# EAGLE board p0x2 (EAGLE 4.11)
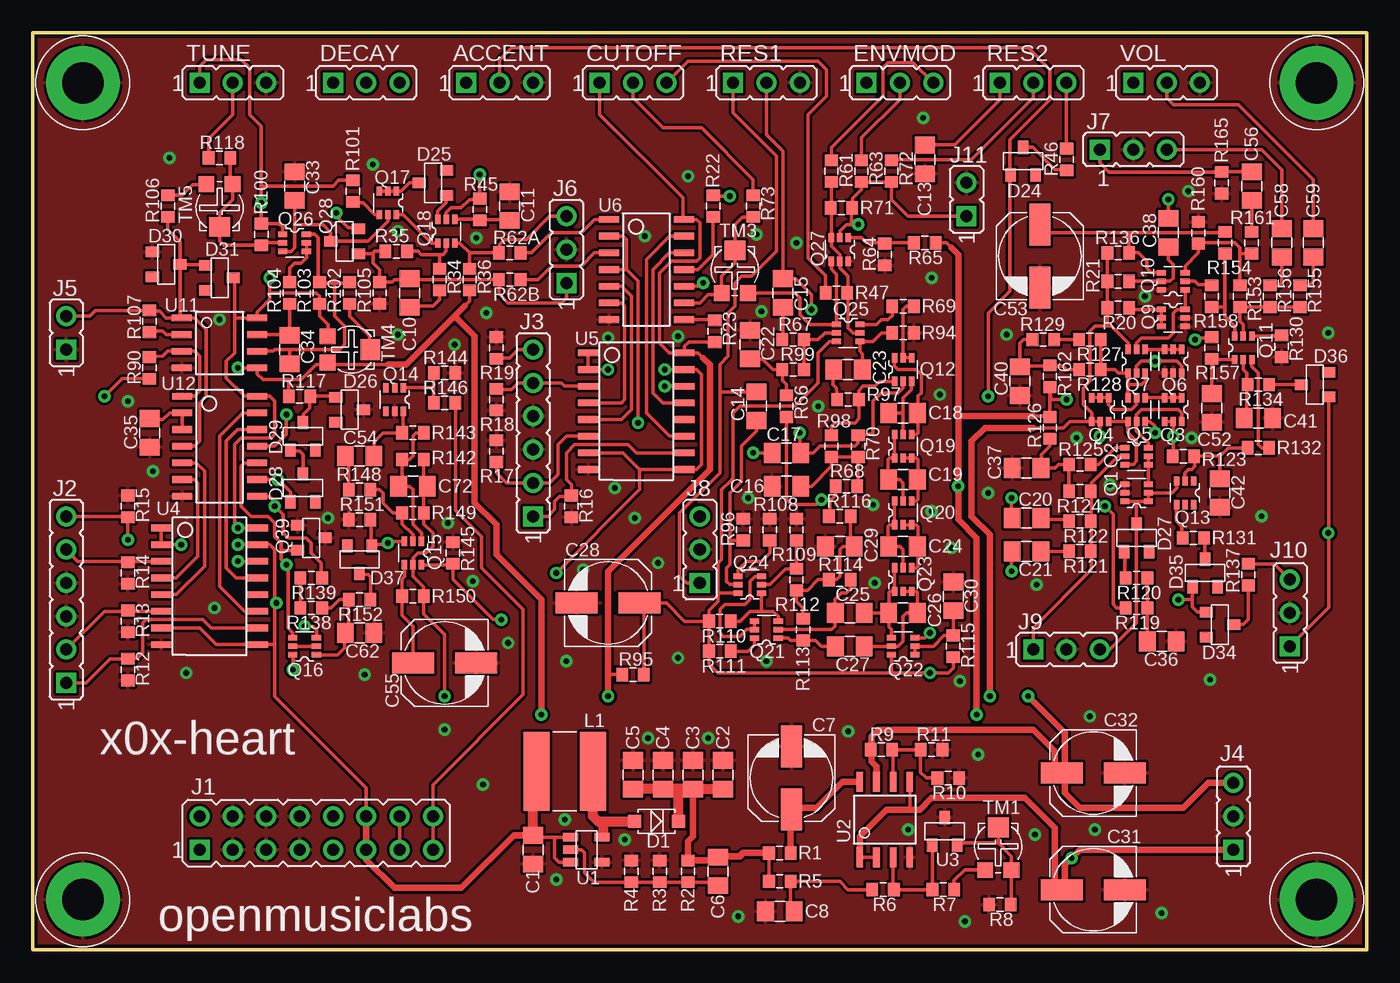
[diagram p1: board, top side]
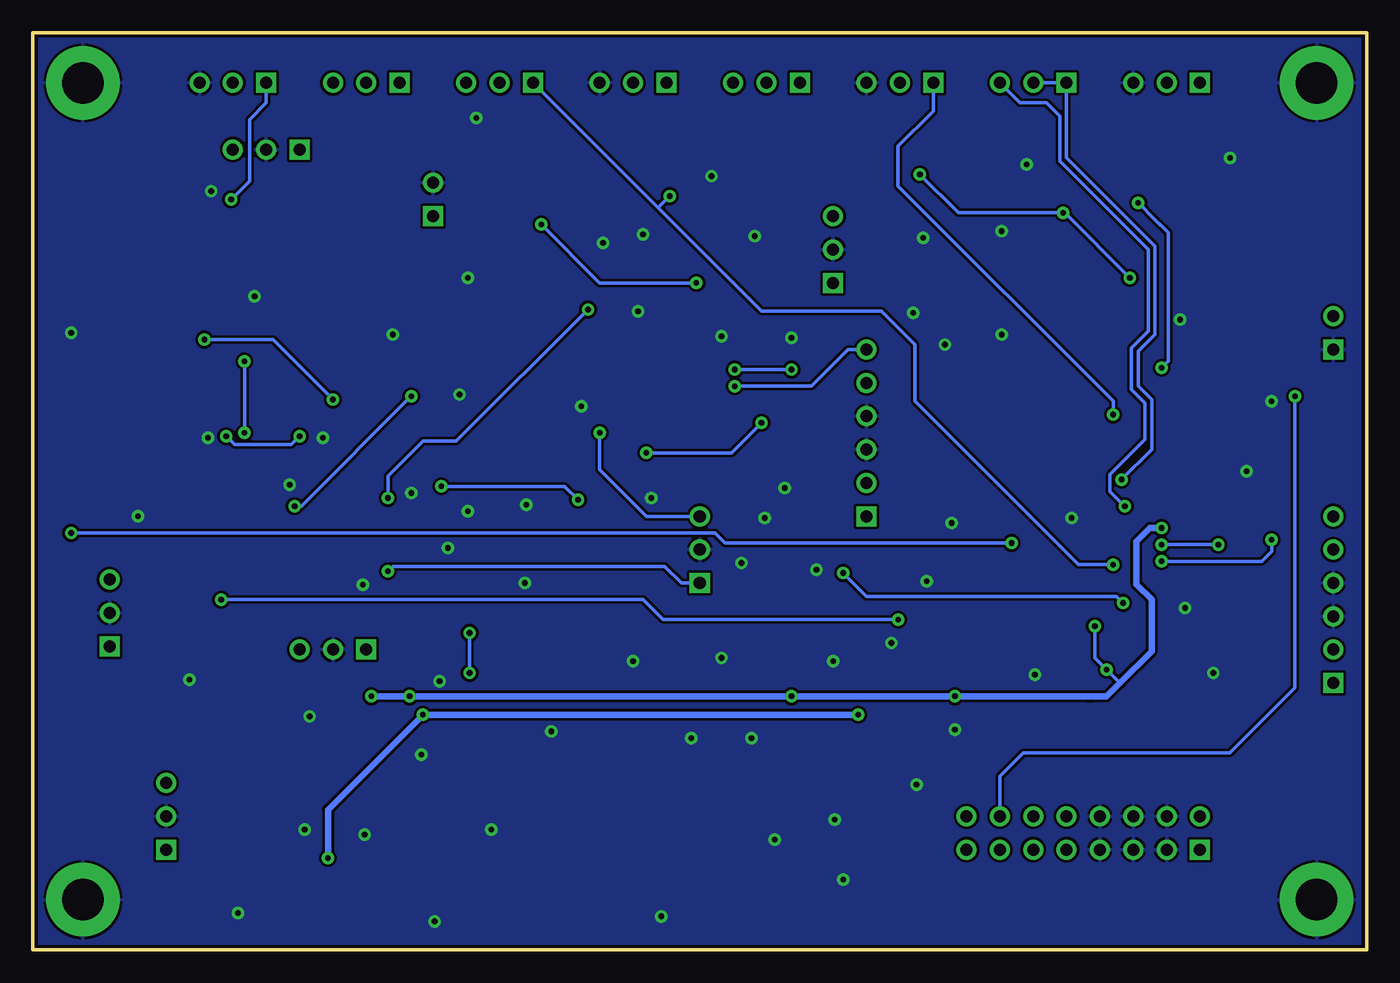
[diagram p2: board, bottom side, seen from below]

Size 101.6 x 69.85 mm. Coordinates in mm from the lower left corner, seen from the top.
Outline: 0,0 0,69.85 101.6,69.85 101.6,0 0,0
Copper layers (1*16): Top 0.035mm / dielectric 1.5mm / Bottom 0.035mm
Design rules "default": minimum track width 8mil, minimum drill 16mil, track to track 8mil, track to pad 8mil, pad to pad 8mil, via to via 8mil, smd to smd 8mil, copper to edge 10mil, drill to drill 8mil, minimum pad ring 10mil, minimum via ring 8mil, stop-mask expansion 4mil, vias tented up to drill 20mil, thermal gap 8mil

## Footprints (pad centres in the part's own frame; a part is rotated, then mirrored left to right if it is on the bottom)
JMP/3P/SIP = drill 0.914 pad 1.524 square: 1 -2.54,0 | drill 0.914 pad 1.524 round: 2 0,0; 3 2.54,0
0805/SMALL = smd 1.27 x 1.524: 1 -1.091,0; 2 1.091,0
CAP/6.3X5.3/SMD = smd 1.6 x 3.2: P$1 0,2.4; P$2 0,-2.4
SOD-123 = smd 1 x 1: P$1 -1.678,0; P$2 1.678,0
SOT-23-3 = smd 0.8 x 1: P$1 0,1.05; P$2 0.95,-1.05; P$3 -0.95,-1.05
JMP/16P/DIP = drill 0.914 pad 1.524 square: 1 -1.27,8.89 | drill 0.914 pad 1.524 round: 2 1.27,8.89; 3 -1.27,6.35; 4 1.27,6.35; 5 -1.27,3.81; 6 1.27,3.81; 7 -1.27,1.27; 8 1.27,1.27; 9 -1.27,-1.27; 10 1.27,-1.27; 11 -1.27,-3.81; 12 1.27,-3.81; 13 -1.27,-6.35; 14 1.27,-6.35; 15 -1.27,-8.89; 16 1.27,-8.89
JMP/6P/SIP = drill 0.914 pad 1.524 square: 1 -6.35,0 | drill 0.914 pad 1.524 round: 2 -3.81,0; 3 -1.27,0; 4 1.27,0; 5 3.81,0; 6 6.35,0
JMP/2P/SIP = drill 0.914 pad 1.524 square: 1 -1.27,0 | drill 0.914 pad 1.524 round: 2 1.27,0
H0LE/PAD/4-40 = drill 3.175 pad 5.588 round: P$1 0,0
SRN6045 = smd 6 x 2: P$1 0,-2.15; P$2 0,2.15
SOT363 = smd 0.42 x 0.7: P$1 -0.65,-0.9; P$2 0,-0.9; P$3 0.65,-0.9; P$4 0.65,0.9; P$5 0,0.9; P$6 -0.65,0.9
0603-SM = smd 0.889 x 1.016: P$1 -0.826,0; P$2 0.826,0
TC33X = smd 1.2 x 1.2: P$1 -1,-1.8; P$3 1,-1.8 | smd 1.6 x 1.5: P$2 0,1.45
SOT23-5 = smd 0.635 x 1.143: P$1 -0.95,-1.2; P$2 0,-1.2; P$3 0.95,-1.2; P$4 0.95,1.2; P$5 -0.95,1.2
8-SOIC = smd 1.524 x 0.508: 1 -2.87,1.905; 2 -2.87,0.635; 3 -2.87,-0.635; 4 -2.87,-1.905; 5 2.87,-1.905; 6 2.87,-0.635; 7 2.87,0.635; 8 2.87,1.905
16-SOIC/WIDE = smd 1.524 x 0.508: 1 -3.683,4.445; 2 -3.683,3.175; 3 -3.683,1.905; 4 -3.683,0.635; 5 -3.683,-0.635; 6 -3.683,-1.905; 7 -3.683,-3.175; 8 -3.683,-4.445; 9 3.683,-4.445; 10 3.683,-3.175; 11 3.683,-1.905; 12 3.683,-0.635; 13 3.683,0.635; 14 3.683,1.905; 15 3.683,3.175; 16 3.683,4.445
14-SOIC = smd 1.524 x 0.508: 1 -2.857,3.81; 2 -2.857,2.54; 3 -2.857,1.27; 4 -2.857,0; 5 -2.857,-1.27; 6 -2.857,-2.54; 7 -2.857,-3.81; 8 2.857,-3.81; 9 2.857,-2.54; 10 2.857,-1.27; 11 2.857,0; 12 2.857,1.27; 13 2.857,2.54; 14 2.857,3.81

## Placement (x,y rotation side)
ACCENT  50kB  [JMP/3P/SIP]  35.56,66.04 0 top
C1  10uF  [0805/SMALL]  38.1,7.62 270 top
C2  1uF  [0805/SMALL]  52.58,13.34 90 top
C3  1uF  [0805/SMALL]  50.29,13.34 90 top
C4  1uF  [0805/SMALL]  48.01,13.34 90 top
C5  1uF  [0805/SMALL]  45.72,13.34 90 top
C6  1nF  [0805/SMALL]  52.2,5.97 270 top
C7  47uF  [CAP/6.3X5.3/SMD]  57.78,13.08 180 top
C8  10uF  [0805/SMALL]  56.9,2.92 180 top
C10  10nF  [0805/SMALL]  28.7,50.04 90 top
C11  1uF  [0805/SMALL]  36.32,56.64 270 top
C13  1uF  [0805/SMALL]  67.94,60.2 270 top
C14  1uF  [0805/SMALL]  55.12,41.4 90 top
C15  1uF  [0805/SMALL]  57.15,50.04 90 top
C16  10uF  [0805/SMALL]  57.4,35.31 0 top
C17  1uF  [0805/SMALL]  57.4,37.85 180 top
C18  18nF  [0805/SMALL]  66.29,40.89 180 top
C19  33nF  [0805/SMALL]  66.29,35.81 180 top
C20  10nF  [0805/SMALL]  75.69,32.89 180 top
C21  10nF  [0805/SMALL]  75.69,30.35 180 top
C22  1uF  [0805/SMALL]  54.61,46.1 90 top
C23  1uF  [0805/SMALL]  62.1,44.2 180 top
C24  33nF  [0805/SMALL]  66.29,30.73 180 top
C25  100nF  [0805/SMALL]  62.23,25.65 180 top
C26  33nF  [0805/SMALL]  66.29,25.65 180 top
C27  100nF  [0805/SMALL]  62.23,23.11 0 top
C28  47uF  [CAP/6.3X5.3/SMD]  43.81,26.42 270 top
C29  1uF  [0805/SMALL]  61.47,30.73 180 top
C30  10uF  [0805/SMALL]  70.1,26.92 90 top
C31  47uF  [CAP/6.3X5.3/SMD]  80.77,4.57 90 top
C32  47uF  [CAP/6.3X5.3/SMD]  80.77,13.46 90 top
C33  10nF  [0805/SMALL]  19.94,58.17 90 top
C34  1nF  [0805/SMALL]  19.56,45.72 270 top
C35  100nF  [0805/SMALL]  8.89,39.37 270 top
C36  33nF  [0805/SMALL]  85.98,23.5 0 top
C37  10uF  [0805/SMALL]  75.69,36.7 180 top
C38  1uF  [0805/SMALL]  86.49,54.61 270 top
C40  10uF  [0805/SMALL]  75.18,43.31 270 top
C41  100nF  [0805/SMALL]  93.34,40.51 0 top
C42  1uF  [0805/SMALL]  90.42,34.8 270 top
C52  10uF  [0805/SMALL]  89.79,41.27 90 top
C53  47uF  [CAP/6.3X5.3/SMD]  76.71,52.83 0 top
C54  47nF  [0805/SMALL]  24.89,37.59 0 top
C55  47uF  [CAP/6.3X5.3/SMD]  31.37,21.84 90 top
C56  1uF  [0805/SMALL]  92.84,58.17 270 top
C58  1uF  [0805/SMALL]  95.12,53.85 90 top
C59  1uF  [0805/SMALL]  97.54,53.85 90 top
C62  1uF  [0805/SMALL]  24.89,24.13 180 top
C72  10uF  [0805/SMALL]  28.96,35.31 0 top
CUTOFF  50kA  [JMP/3P/SIP]  45.72,66.04 0 top
D1  MBR0530  [SOD-123]  47.5,9.78 180 top
D24  [SOT-23-3]  75.44,60.07 0 top
D25  [SOT-23-3]  30.48,58.42 90 top
D26  [SOT-23-3]  24.13,41.15 270 top
D27  [SOT-23-3]  84.07,31.37 0 top
D28  [SOT-23-3]  20.57,35.18 0 top
D29  [SOT-23-3]  20.57,39.12 0 top
D30  [SOT-23-3]  10.16,52.2 270 top
D31  [SOT-23-3]  14.22,51.18 270 top
D34  [SOT-23-3]  90.42,24.77 270 top
D35  [SOT-23-3]  89.28,28.7 0 top
D36  [SOT-23-3]  97.66,43.05 90 top
D37  [SOT-23-3]  24.89,29.72 180 top
DECAY  1MA  [JMP/3P/SIP]  25.4,66.04 0 top
ENVMOD  50kA  [JMP/3P/SIP]  66.04,66.04 0 top
J1  [JMP/16P/DIP]  21.59,8.89 90 top
J2  [JMP/6P/SIP]  2.54,26.67 90 top
J3  [JMP/6P/SIP]  38.1,39.37 90 top
J4  [JMP/3P/SIP]  91.44,10.16 90 top
J5  [JMP/2P/SIP]  2.54,46.99 90 top
J6  [JMP/3P/SIP]  40.64,53.34 90 top
J7  [JMP/3P/SIP]  83.82,60.96 0 top
J8  [JMP/3P/SIP]  50.8,30.48 90 top
J9  [JMP/3P/SIP]  78.74,22.86 0 top
J10  [JMP/3P/SIP]  95.76,25.65 90 top
J11  [JMP/2P/SIP]  71.12,57.15 90 top
J12  [H0LE/PAD/4-40]  3.81,66.04 0 top
J13  [H0LE/PAD/4-40]  3.81,3.81 0 top
J14  [H0LE/PAD/4-40]  97.79,66.04 0 top
J15  [H0LE/PAD/4-40]  97.79,3.81 0 top
L1  SRN6045-8R2M  [SRN6045]  40.51,13.59 270 top
Q1  [SOT363]  84.07,34.8 90 top
Q2  [SOT363]  84.07,37.59 270 top
Q3  [SOT363]  86.87,41.15 180 top
Q4  [SOT363]  81.28,41.15 180 top
Q5  [SOT363]  84.07,41.15 0 top
Q6  [SOT363]  86.87,44.83 180 top
Q7  [SOT363]  84.07,44.83 0 top
Q9  [SOT363]  86.87,48.13 270 top
Q10  [SOT363]  86.87,50.93 90 top
Q11  [SOT363]  92.2,45.85 0 top
Q12  [SOT363]  66.29,44.2 0 top
Q13  [SOT363]  87.76,34.8 180 top
Q14  [SOT363]  27.56,41.91 180 top
Q15  [SOT363]  28.96,30.23 180 top
Q16  [SOT363]  20.7,23.11 90 top
Q17  [SOT363]  27.05,56.9 180 top
Q18  [SOT363]  31.5,54.74 0 top
Q19  [SOT363]  66.29,38.35 0 top
Q20  [SOT363]  66.29,33.27 0 top
Q21  [SOT363]  55.88,24.38 90 top
Q22  [SOT363]  66.29,23.11 90 top
Q23  [SOT363]  66.29,28.19 0 top
Q24  [SOT363]  54.61,27.81 90 top
Q25  [SOT363]  62.1,46.99 270 top
Q26  [SOT363]  19.94,53.85 270 top
Q27  [SOT363]  61.47,53.34 180 top
Q28  2SK3666-2  [SOT-23-3]  23.75,53.98 90 top
Q39  2SK3666-3  [SOT-23-3]  21.21,31.37 270 top
R1  100  [0603-SM]  56.9,7.37 0 top
R2  100k  [0603-SM]  49.91,5.97 90 top
R3  47k  [0603-SM]  47.75,5.97 270 top
R4  10k  [0603-SM]  45.59,5.97 270 top
R5  1k  [0603-SM]  56.9,5.21 0 top
R6  10k  [0603-SM]  64.77,4.57 180 top
R7  10k  [0603-SM]  69.34,4.57 180 top
R8  10k  [0603-SM]  73.66,3.43 0 top
R9  2.2k  [0603-SM]  64.64,15.24 180 top
R10  10k  [0603-SM]  69.72,13.08 180 top
R11  2.2k  [0603-SM]  68.45,15.24 180 top
R12  100k  [0603-SM]  7.24,21.34 90 top
R13  100k  [0603-SM]  7.24,25.02 90 top
R14  100k  [0603-SM]  7.24,28.7 90 top
R15  100k  [0603-SM]  7.24,33.78 270 top
R16  100k  [0603-SM]  41.02,33.78 90 top
R17  100k  [0603-SM]  35.31,37.97 270 top
R18  100k  [0603-SM]  35.31,41.91 90 top
R19  100k  [0603-SM]  35.31,45.85 270 top
R20  47k  [0603-SM]  82.68,48.9 0 top
R21  10k  [0603-SM]  82.68,50.93 0 top
R22  220k  [0603-SM]  51.82,56.64 90 top
R23  47k  [0603-SM]  51.94,47.12 270 top
R34  10k  [0603-SM]  30.99,51.05 90 top
R35  100k  [0603-SM]  27.69,53.21 0 top
R36  10k  [0603-SM]  33.27,51.05 90 top
R45  22k  [0603-SM]  34.04,56.39 270 top
R46  47k  [0603-SM]  78.74,60.2 90 top
R47  10k  [0603-SM]  61.21,50.04 0 top
R61  10k  [0603-SM]  60.83,59.31 90 top
R62A  220k  [0603-SM]  36.32,53.09 180 top
R62B  220k  [0603-SM]  36.32,51.05 180 top
R63  220k  [0603-SM]  63.12,59.31 90 top
R64  10k  [0603-SM]  64.9,52.96 90 top
R65  10k  [0603-SM]  67.94,53.85 0 top
R66  100k  [0603-SM]  57.4,41.4 90 top
R67  2.2k  [0603-SM]  57.91,46.48 0 top
R68  2.2k  [0603-SM]  61.98,35.31 180 top
R69  2.2k  [0603-SM]  66.29,49.02 0 top
R70  2.2k  [0603-SM]  62.87,38.35 90 top
R71  2.2k  [0603-SM]  61.59,56.52 0 top
R72  100k  [0603-SM]  65.41,59.31 90 top
R73  100k  [0603-SM]  54.86,56.64 90 top
R90  220k  [0603-SM]  8.89,44.32 90 top
R94  10k  [0603-SM]  66.29,46.99 180 top
R95  100  [0603-SM]  45.72,20.95 180 top
R96  10k  [0603-SM]  54.1,32 90 top
R97  10k  [0603-SM]  62.1,41.91 180 top
R98  2.2k  [0603-SM]  60.83,38.35 90 top
R99  100k  [0603-SM]  57.91,44.2 180 top
R100  560  [0603-SM]  17.4,54.48 270 top
R101  10k  [0603-SM]  24.38,57.78 270 top
R102  100k  [0603-SM]  24.13,50.04 270 top
R103  220k  [0603-SM]  21.84,50.04 270 top
R104  2.2k  [0603-SM]  19.56,50.04 90 top
R105  10k  [0603-SM]  26.42,50.04 90 top
R106  27k  [0603-SM]  10.29,56.64 90 top
R107  220k  [0603-SM]  8.89,47.88 90 top
R108  2.2k  [0603-SM]  56.13,32 90 top
R109  10k  [0603-SM]  58.17,32 90 top
R110  22k  [0603-SM]  52.32,25.02 0 top
R111  22k  [0603-SM]  52.32,22.73 0 top
R112  10k  [0603-SM]  58.17,28.19 90 top
R113  100k  [0603-SM]  58.67,24.38 90 top
R114  100k  [0603-SM]  61.47,28.19 180 top
R115  10k  [0603-SM]  70.1,23.11 90 top
R116  10k  [0603-SM]  61.47,33.02 0 top
R117  22k  [0603-SM]  20.32,42.16 0 top
R118  100k  [0603-SM]  14.22,60.33 180 top
R119  47k  [0603-SM]  84.07,26.04 0 top
R120  22k  [0603-SM]  84.07,28.32 180 top
R121  220k  [0603-SM]  79.76,30.35 180 top
R122  100k  [0603-SM]  79.76,32.64 180 top
R123  1.5M  [0603-SM]  87.63,37.59 0 top
R124  2.2k  [0603-SM]  79.76,34.92 0 top
R125  2.2k  [0603-SM]  79.76,36.96 0 top
R126  2.2k  [0603-SM]  77.47,39.75 270 top
R127  47k  [0603-SM]  80.52,46.48 180 top
R128  220k  [0603-SM]  80.52,44.2 180 top
R129  22k  [0603-SM]  76.96,46.48 180 top
R130  100  [0603-SM]  95.12,45.97 90 top
R131  220k  [0603-SM]  88.39,31.37 180 top
R132  100  [0603-SM]  93.34,38.23 0 top
R134  22k  [0603-SM]  93.34,43.05 0 top
R136  100  [0603-SM]  82.68,53.09 0 top
R137  1k  [0603-SM]  92.58,28.57 270 top
R138  47k  [0603-SM]  21.21,26.04 0 top
R139  22k  [0603-SM]  21.21,28.32 180 top
R142  10k  [0603-SM]  28.96,37.34 0 top
R143  10k  [0603-SM]  28.96,39.37 0 top
R144  10k  [0603-SM]  31.37,43.94 0 top
R145  10k  [0603-SM]  32,30.23 270 top
R146  22k  [0603-SM]  31.37,41.66 180 top
R148  10k  [0603-SM]  24.89,35.05 0 top
R149  10k  [0603-SM]  28.96,33.27 0 top
R150  22  [0603-SM]  28.96,26.92 0 top
R151  22k  [0603-SM]  24.89,32.77 0 top
R152  100  [0603-SM]  24.89,26.67 0 top
R153  100k  [0603-SM]  91.95,49.78 90 top
R154  100k  [0603-SM]  90.81,53.85 90 top
R155  47k  [0603-SM]  96.52,49.78 270 top
R156  100k  [0603-SM]  94.23,49.78 270 top
R157  10k  [0603-SM]  89.79,45.85 270 top
R158  10k  [0603-SM]  89.79,49.78 90 top
R160  10k  [0603-SM]  88.77,54.61 270 top
R161  1k  [0603-SM]  92.84,53.85 270 top
R162  2.2k  [0603-SM]  77.47,43.69 90 top
R165  100k  [0603-SM]  90.55,58.42 270 top
RES1  50kB  [JMP/3P/SIP]  55.88,66.04 0 top
RES2  50kB  [JMP/3P/SIP]  76.2,66.04 0 top
TM1  5k  [TC33X]  73.53,7.87 0 top
TM3  500k  [TC33X]  53.47,51.82 0 top
TM4  50k  [TC33X]  24.26,45.72 270 top
TM5  5k  [TC33X]  14.22,56.52 180 top
TUNE  50kB  [JMP/3P/SIP]  15.24,66.04 0 top
U1  NCP1406  [SOT23-5]  42.16,7.62 270 top
U2  LM358  [8-SOIC]  64.9,9.91 90 top
U3  TLV431  [SOT-23-3]  69.47,9.02 0 top
U4  CD40109  [16-SOIC/WIDE]  13.46,27.69 0 top
U5  CD40109  [16-SOIC/WIDE]  45.97,41.02 0 top
U6  CD4066  [14-SOIC]  46.74,51.82 0 top
U11  LM358  [8-SOIC]  14.22,46.23 0 top
U12  CD4066  [14-SOIC]  14.22,38.35 0 top
VOL  50kA  [JMP/3P/SIP]  86.36,66.04 0 top

## Tracks (layer width: path | path; a pad name or v marks a point on that pad's centre or on a via)
+5V  (via drill 0.43 pad 0.94)
  Top 0.254: 19.04,54.99 Q26.P$1 | 19.04,54.99 19.04,55 | v15.62,44.32 U11.5 17.09,43.87 17.53,43.43 19.43,43.43 | 69.98,53.47 69.6,53.85 R65.P$2 | U2.2 64.26,6.99 64.21,7.04 U2.1 | 66.8,12.83 U2.5 66.8,10.67 66.8,10.54 | R101.P$1 23.3,58.61 22.86,58.17 17.4,58.17 | 19.04,54.99 19.05,54.99 18.73,55.31 R100.P$1 v17.4,56.9 17.4,58.17 | 17.4,58.17 17.4,62.74 16.51,63.63 16.51,67.18 15.88,67.82 13.21,67.82 12.7,67.31 TUNE.1 | 19.43,43.43 19.56,43.43 19.49,43.37 R117.P$1 | 19.43,43.43 20.45,43.43 21.59,44.58 22.23,44.58 | TM4.P$3 22.35,44.62 22.35,44.58 22.23,44.58 | 27.05,44.58 22.23,44.58 | 33.27,50.29 33.27,50.42 | 33.27,50.29 R36.P$1 | 32.89,49.02 33.27,49.4 33.27,50.29 | v78.74,41.91 77.53,41.91 R162.P$1 77.47,40.77 77.34,40.64 | R157.P$1 89.79,46.61 88.65,46.61 v88.52,46.48 | R116.P$1 60.71,33.02 60.71,33.91 | 60.71,33.91 60.71,34.04 | R126.P$1 77.41,40.64 77.34,40.64 | 76.2,40.64 77.34,40.64 | 60.71,34.29 v60.07,34.29 59.69,33.91 57.78,33.91 57.4,34.29 R66.P$1 | 60.71,34.29 60.71,33.91 | 60.71,34.29 60.83,34.29 61.15,34.61 R68.P$2
  Top 0.508: 62.99,6.99 U2.1 62.99,8.64 65.02,10.67 66.8,10.67 67.56,10.67 68.45,11.56 75.56,11.56 77.85,9.27 77.85,4.7 77.98,4.57 C31.P$1 78.61,4.81 78.61,6.48 v79.12,6.99 79.76,7.62 J4.1 | v38.73,17.91 38.73,26.67 35.31,30.1 35.31,32.38 33.66,34.04 33.66,46.74 32.13,48.26 | 27.05,44.58 28.45,44.58 32.13,48.26 | 32.13,48.26 32.89,49.02 | v71.88,17.91 71.88,31.37 70.48,32.77 v70.48,35.31 70.48,41.15 | 70.48,41.15 70.48,52.96 69.98,53.47 | 76.2,40.64 70.48,40.64 70.48,41.15
  Bottom 0.254: 15.62,44.2 v15.62,44.32 15.11,44.83 15.11,54.61 16.13,55.63 | 16.13,55.63 v17.4,56.9 | 16.13,55.63 15.62,55.12 | v78.74,41.91 83.31,46.48 v88.52,46.48 | v70.48,35.31 61.09,35.31 v60.07,34.29
  Bottom 0.508: v79.12,6.99 79.12,10.67 v71.88,17.91 v38.73,17.91
+12V  (via drill 0.43 pad 0.94)
  Top 0.254: 39.75,8.57 38.1,8.57 C1.1 | 39.75,8.57 U1.P$1 | U1.P$3 40.07,6.67 39.75,6.99 39.75,8.57 | J1.12 25.4,12.32 18.41,19.3 18.41,23.24 | v15.62,30.86 U4.15 18.03,30.86 18.41,30.48 18.41,26.42 | U4.2 v11.3,30.86 U4.2 | U4.7 12.7,24.51 13.97,23.24 U4.9 18.41,23.24 | 18.41,23.24 18.41,26.42 | 43.81,37.85 U5.7 44.96,37.85 46.23,36.58 | v48.13,44.2 U5.15 50.55,44.2 50.93,43.81 50.93,36.96 50.55,36.58 U5.9 46.23,36.58 | v43.81,44.2 U5.2 U5.1 | v39.88,28.7 46.23,35.05 46.23,36.58 | U4.2 U4.1 | 18.41,26.42 v18.54,26.42
  Top 0.508: J1.12 J1.11 25.4,6.86 27.56,4.7 32.64,4.7 36.65,8.71 C1.1
  Top 0.762: L1.P$1 38.48,13.59 38.1,13.21 C1.1
  Bottom 0.254: v15.62,30.86 v11.3,30.86 | v48.13,44.2 v43.81,44.2 | v39.88,28.7 38.1,26.92 19.05,26.92 v18.54,26.42
ENVMOD  (via drill 0.43 pad 0.94)
  Top 0.254: Q16.P$4 19.8,24.14 19.43,24.51 19.43,29.21 v19.3,29.34 18.92,29.72 18.92,30.48 | 17.14,37.08 U12.10 16.13,37.08 15.88,36.83 15.88,33.78 16.64,33.02 17.91,33.02 18.41,32.51 18.41,31.5 18.92,30.99 18.92,30.48 | Q39.P$2 18.98,30.42 18.92,30.48 | R22.P$2 51.82,57.4 v53.09,57.4
  Bottom 0.254: v19.3,29.34 21.97,29.34 34.42,41.78 34.42,46.1 36.96,48.64 46.1,48.64 53.98,56.52 | 53.98,56.52 ENVMOD.1 | 53.98,56.52 v53.09,57.4
N$1
  Top 0.254: R137.P$1 94.55,29.4 J10.3
N$2
  Top 0.254: R139.P$2 R138.P$1 20.45,26.29
N$3
  Top 0.254: U6.11 50.67,51.82 51.82,52.96 R22.P$1
N$4
  Top 0.254: R90.P$2 9.91,45.21 10.29,45.59 U11.3 12.32,45.59 12.7,45.21 12.7,42.55 12.32,42.16 U12.1 11.3,42.16
N$5
  Top 0.254: 11.3,38.35 U12.4 12.32,38.35 12.7,38.73 12.7,41.66 13.21,42.16 13.21,47.24 12.32,48.13 U11.1 11.3,48.13 | 11.3,48.13 10.16,48.13 9.65,48.64 8.76,48.64 8.83,48.7 R107.P$2 4.76,48.7 4.32,48.26 J5.2 | D31.P$3 13.21,52.16 13.21,52.2 D30.P$1 | D30.P$1 11.21,48.13 11.3,48.13 | D30.P$1 11.21,53.94 10.29,54.86 R106.P$1 10.29,55.88
N$6
  Top 0.254: U11.2 10.16,46.86 9.91,47.12 8.89,47.12 R107.P$1
N$7
  Top 0.254: Q26.P$4 20.83,53.21 20.84,53.22 Q26.P$5 | Q26.P$4 | Q26.P$4 20.84,52.72 20.45,52.32 19.94,52.32 19.56,51.94 R104.P$2
N$8
  Top 0.254: C34.1 19.56,46.35 | C34.1 19.56,46.86 U11.7 | 19.56,49.28 R104.P$1 C34.1
N$9
  Top 0.254: 21.77,50.83 21.72,50.8 22.99,50.8 | 21.77,50.83 R103.P$1 | Q26.P$6 21.45,54.5 21.72,54.23 21.72,50.93 21.77,50.88 21.77,50.83 | R102.P$1 24,50.8 22.99,50.8 | 22.99,50.8 22.99,48.26 23.75,47.5 23.75,46.1 23.37,45.72 19.56,45.72 | U11.6 18.29,45.59 18.41,45.72 19.56,45.72 | 19.56,45.72 C34.2
N$10
  Top 0.254: R106.P$2 11.37,57.47 12.19,58.29 13.21,58.29 TM5.P$3
N$11
  Top 0.254: Q26.P$3 19.67,53.2 19.94,53.47 19.94,55.24 | 19.94,55.24 C33.1 | 19.94,55.24 22.1,55.24 22.7,54.64 Q28.P$1 25.53,53.98 27.05,55.5 Q17.P$5
N$12
  Top 0.254: R62A.P$1 37.97,53.09 39.5,54.61 41.78,54.61 42.8,55.63 U6.1
  Top 0.406: U6.1 44.07,55.63
N$13
  Top 0.254: RES2.1 73.66,64.77 70.23,61.34 67.94,61.34 C13.1
N$14
  Top 0.254: C10.2 28.65,51.13 28.57,51.05 28.83,51.05 28.96,51.05 | 28.96,51.05 R62B.P$2 35.5,49.97 36.2,49.28 40.26,49.28 40.64,49.66 J6.1 | Q28.P$3 25.85,53.02 25.91,53.09 | 25.91,53.09 26.04,53.21 R35.P$1 26.92,53.21 | 25.91,53.09 25.91,52.32 26.42,51.82 R105.P$2 27.37,50.86 27.56,51.05 28.96,51.05
N$15
  Top 0.254: Q17.P$4 26.05,56 25.15,56.9 24.38,56.9 R101.P$2
N$16
  Top 0.254: Q18.P$6 30.85,56.25 31.5,56.9 31.5,57.53 31.53,57.5 D25.P$3
N$17
  Top 0.254: Q17.P$3 Q17.P$2 27.05,57.78 Q17.P$2 27.68,57.8 27.69,57.78 Q17.P$1 28.06,57.8 28.07,57.78 28.7,58.42 D25.P$1
N$18
  Top 0.254: Q17.P$6 28.18,56 28.19,56.01 30.36,53.84 Q18.P$1
N$19
  Top 0.254: Q18.P$4 34.15,55.64 34.16,55.63 34.1,55.56 R45.P$2 34.1,55.63 36.4,55.63 | 36.4,55.63 36.45,55.63 | 36.4,55.63 C11.2
N$20
  Top 0.254: Q18.P$3 32.52,53.84 33.27,53.09 | 33.27,53.09 R62A.P$2 35.56,53.09 35.56,53.72 35.94,54.1 37.59,54.1 39.37,55.88 J6.3 | 33.27,53.09 R36.P$2
N$21
  Top 0.254: Q18.P$2 31.5,53.21 31.24,52.96 30.99,52.96 | 30.99,52.96 29.59,52.96 29.34,53.21 R35.P$2 28.45,53.21 | 30.99,52.96 R34.P$2
N$22
  Top 0.254: R62B.P$1 38.48,51.05 39.5,52.07 41.78,52.07 42.8,53.09 U6.3 44.07,53.09
N$23
  Top 0.254: R34.P$1 30.99,49.53 30.48,49.02 28.7,49.02 C10.1
N$24  (via drill 0.43 pad 0.94)
  Top 0.254: R70.P$2 62.99,39.24 | Q12.P$2 66.29,42.8 65.91,42.42 64.64,42.42 64.01,41.78 64.01,39.37 63.63,39.24 R70.P$2 | R70.P$2 62.87,38.61 62.61,38.35 59.94,38.35 59.44,37.85 C17.1 58.42,37.85 v58.42,39.37
  Bottom 0.254: v58.42,39.37 58.42,36.58 54.86,33.02 J8.3
N$25
  Top 0.254: Q12.P$4 66.93,45.09 66.92,45.1 Q12.P$5 | Q12.P$5 66.29,45.09 | Q12.P$5 66.29,48.77 66.55,49.02 R69.P$2 67.31,49.02
N$26
  Top 0.254: 66.29,40.89 66.29,42.04 66.93,42.67 Q12.P$3 | C18.2 66.29,40.89 | 66.29,40.89 Q19.P$5
N$27
  Top 0.254: Q19.P$6 65.66,39.24 65.64,39.23 Q19.P$1 65.27,37.45 65.15,37.34 65.15,35.81 C19.2 66.04,35.81 66.29,35.56 Q20.P$5
N$28
  Top 0.254: Q20.P$1 65.66,32.38 65.64,32.4 Q20.P$6 | Q20.P$1 | Q23.P$5 66.29,30.48 66.04,30.73 C24.2 65.15,30.73 | 65.15,30.73 65.02,30.73 | Q20.P$1 65.27,32.37 65.15,32.26 65.15,30.73
N$29
  Top 0.254: Q19.P$2 66.92,37.45 66.93,37.47 Q19.P$3 67.32,37.45 67.44,37.34 67.44,35.69 | Q20.P$4 67.32,34.17 67.44,34.29 67.44,35.69 | C19.1 67.44,35.81 67.44,35.69
N$30
  Top 0.254: Q19.P$4 67.32,39.25 67.44,39.37 67.44,40.89 | 67.44,40.89 67.44,41.02 67.39,40.97 C18.1 67.44,40.89 | Q12.P$6 65.64,44.47 65.91,44.2 67.31,44.2 67.69,43.81 67.69,42.42 67.44,42.16 67.44,40.89
N$31
  Top 0.254: Q20.P$2 66.92,32.37 66.93,32.38 Q20.P$3 67.32,32.37 67.44,32.26 67.44,30.73 | Q23.P$4 67.32,29.09 67.44,29.21 67.44,30.73 | 67.44,30.73 C24.1
N$32
  Top 0.254: Q23.P$2 66.92,27.29 66.93,27.3 Q23.P$3 67.3,27.29 67.31,27.3 67.39,27.23 C26.1 66.55,25.65 66.29,25.4 66.29,23.5 65.91,23.11 Q22.P$5 C27.2 | C27.2 63.25,23.37 | C27.2 63.25,23.11
N$33
  Top 0.254: 63.25,25.65 C25.1 C26.2 | C26.2 65.28,25.65 | C26.2 65.2,24.59 65.41,24.38 65.41,23.75 Q22.P$4 | Q23.P$6 65.64,27.32 65.66,27.3 Q23.P$1 65.29,27.29 65.28,27.3 65.2,27.23 C26.2
N$34
  Top 0.254: 70.1,25.91 C30.1 R115.P$2 | R115.P$2 70.23,24 70.22,24.01 | Q22.P$1 67.18,22.48 67.19,22.49 Q22.P$2 | R115.P$2 69.41,23.94 68.58,23.11 Q22.P$2 | Q22.P$2
N$35
  Top 0.254: R98.P$1 60.83,37.59 | 63.25,37.47 R70.P$1 62.87,37.47 | R98.P$1 62.8,37.53 62.87,37.47 | R68.P$1 62.87,35.31 62.87,37.47 | R98.P$1 60.83,36.83 59.31,35.31 C16.2 58.42,35.31
N$36
  Top 0.254: Q12.P$1 64.5,43.3 64.14,42.93 63.25,42.93 62.93,42.61 R97.P$1 62.93,40.45 62.61,40.13 61.09,40.13 60.83,39.88 R98.P$2 60.83,39.12
N$37
  Top 0.254: Q25.P$5 62.48,46.99 62.1,47.37 62.1,49.91 | 62.1,49.91 62.1,50.04 R47.P$2 | 62.1,49.91 62.1,51.31 61.47,51.94 Q27.P$5 61.47,52.96 60.82,53.61 Q27.P$3 60.82,56.64 | 60.82,56.64 60.77,56.64 R71.P$1 60.83,56.52 R61.P$1 60.83,58.55 | 60.82,56.64 60.83,56.64
N$38
  Top 0.254: 64.77,53.85 R64.P$2 65.02,53.85 | 65.02,53.85 R65.P$1 | Q27.P$1 63.11,54.24 63.5,53.85 65.02,53.85
N$39
  Top 0.254: Q27.P$4 60.82,51.83 61.21,51.44 61.21,47.62 | 61.21,47.62 Q25.P$1 | 61.21,47.62 59.18,47.62 58.42,48.39 58.42,49.66 58.04,50.04 54.45,50.04 | 54.45,50.04 54.36,50.04 | TM3.P$3 54.45,50.04
N$40  (via drill 0.43 pad 0.94)
  Top 0.254: J1.14 J1.13 | R90.P$1 6.79,43.5 v5.46,42.16
  Bottom 0.254: v5.46,42.16 5.46,19.94 10.41,14.99 26.16,14.99 27.94,13.21 J1.14
N$41
  Top 0.254: R69.P$1 65.47,48.32 65.15,48.01 64.64,48.01 64.28,47.64 Q25.P$6
N$42  (via drill 0.43 pad 0.94)
  Top 0.254: 70.1,22.48 R115.P$1 70.1,21.46 69.72,21.08 v68.33,21.08 65.41,21.08 | 65.41,21.08 52.2,21.08 51.5,21.78 R111.P$1 R110.P$1 | R110.P$1 51.31,24.89 | Q25.P$3 60.69,46.34 59.82,45.47 59.82,43.18 58.04,41.4 53.85,41.4 53.34,40.89 53.34,35.94 53.09,35.69 52.45,35.05 52.45,29.72 52.2,29.46 52.2,27.56 | Q22.P$6 65.41,22.46 65.41,21.08 | Q22.P$3 67.96,23.76 v68.33,24.13 | R110.P$1 51.5,25.84 52.2,26.54 52.2,27.56 | 46.1,26.42 C28.P$1 46.23,26.42 46.55,26.1 | R95.P$1 46.55,26.1 | 46.55,26.1 46.86,26.42 48.26,26.42 49.66,25.02 R110.P$1 | R110.P$1 51.56,25.02 | Q24.P$6 52.2,27.16 52.2,27.56
  Bottom 0.254: v68.33,21.08 v68.33,24.13
N$43
  Top 0.254: Q21.P$2 60.83,24.38 61.09,24.64 61.09,25.53 | C25.2 61.09,25.65 61.09,25.53 | R114.P$1 62.29,27.5 61.98,27.18 61.59,27.18 61.09,26.67 61.09,25.53
N$44
  Top 0.254: Q21.P$4 54.98,24.39 Q21.P$5 54.36,24.38 53.85,23.88 52.58,23.88 52.32,24.13 52.32,25.91 52.7,26.29 54.23,26.29 54.61,26.67 54.61,28.07 54.99,28.45 55.5,28.45 Q24.P$3
N$45
  Top 0.254: Q21.P$3 56.78,25.39 56.39,25.78 55.5,25.78 | 55.5,25.78 54.61,25.78 53.85,25.02 R110.P$2 | Q24.P$1 55.51,25.79 55.5,25.78
N$46
  Top 0.254: Q21.P$6 54.98,23.23 54.48,22.73 R111.P$2
N$47
  Top 0.254: 60.33,28.07 60.45,28.19 R114.P$2 60.83,28.19 | 60.83,28.19 61.21,28.19 61.47,28.45 61.47,30.48 61.72,30.73 62.48,30.73 | 62.61,30.73 C29.1 62.48,30.73 | 58.67,25.15 R113.P$2 58.67,26.04 58.17,26.54 R112.P$1 58.99,27.37 59.82,28.19 60.83,28.19 | R116.P$2 62.29,30.92 62.48,30.73
N$48
  Top 0.254: 61.21,23.11 C27.1 60.07,23.11 59.63,23.56 R113.P$1 57.72,23.56 57.53,23.75 56.77,23.75 Q21.P$1
N$49
  Top 0.254: R96.P$1 54.23,31.11 | 53.85,27.81 Q24.P$5 53.09,27.81 52.83,28.07 52.83,29.08 53.09,29.34 53.09,31.11 | R96.P$1 54.1,31.24 | R96.P$1 53.09,31.18 53.09,31.11 | C14.1 55.12,39.5 53.98,38.35 53.98,35.69 53.09,34.8 53.09,31.11
N$50
  Top 0.254: Q24.P$4 53.71,28.95 54.36,29.59 55.5,29.59 56.13,30.23 R108.P$1
N$51
  Top 0.254: 58.17,31.24 R109.P$1 R112.P$2 57.34,29.02 56.64,28.32 56.13,27.81 Q24.P$2
N$52  (via drill 0.43 pad 0.94)
  Top 0.254: RES1.1 53.34,63.75 56.64,60.45 56.64,53.21 54.74,51.31 53.98,51.31 53.47,50.8 53.47,49.02 52.96,48.51 52.96,45.21 52.32,44.58 52.32,42.8 | J8.1 49.78,27.94 49.28,28.45 49.28,33.27 52.32,36.32 52.32,42.8 | 74.68,30.35 C21.2 74.55,30.35 v74.55,28.83 | C14.2 52.32,42.49 52.32,42.8
  Bottom 0.254: 50.67,27.94 J8.1 52.2,27.94 53.47,29.21 74.17,29.21 v74.55,28.83
N$53
  Top 0.254: U6.9 50.8,49.28 51.44,49.91 52.57,49.91 | 53.47,53.09 TM3.P$2 53.47,53.47 | R73.P$1 54.04,55.82 53.47,55.24 53.47,53.47 | 52.57,49.91 52.58,49.91 | 52.57,49.91 TM3.P$1 52.47,51.32 53.47,52.32 53.47,53.34 53.59,53.47 53.47,53.47
N$54  (via drill 0.43 pad 0.94)
  Top 0.254: C15.2 57.15,51.18 | RES1.2 55.88,62.1 57.15,60.83 C15.2 | C15.2 58.09,51.13 59.31,49.91 v59.31,48.77 | C20.2 74.55,32.95 v74.55,34.42
  Bottom 0.254: v59.31,48.77 69.34,38.73 71.88,38.73 74.55,36.07 v74.55,34.42
N$55
  Top 0.254: R67.P$1 57.02,46.48 57.15,46.61 C15.1
N$56
  Top 0.254: CUTOFF.2 45.72,64.9 48.01,62.61 49.78,62.61 | 49.78,62.61 49.91,62.61 | R73.P$2 54.86,58.67 50.93,62.61 49.78,62.61
N$57
  Top 0.254: C22.1 55.57,45.01 56.39,44.2 R99.P$2 57.09,43.37 57.4,43.05 R66.P$2 57.4,42.16
N$58
  Top 0.254: 65.53,46.99 R94.P$2 64.64,46.99 63.99,46.34 Q25.P$4 62.99,46.35 62.99,45.59 63.19,45.39 C23.1
N$59
  Top 0.254: R61.P$2 60.83,61.09 64.77,65.02 64.77,67.18 65.15,67.56 67.06,67.56 ENVMOD.3
N$60
  Top 0.254: R47.P$1 60.39,51.37 59.05,52.7 59.05,63.63 60.45,65.02 60.45,67.06 59.82,67.69 49.91,67.69 CUTOFF.3
N$61
  Top 0.254: 63.25,59.94 R63.P$2 63.12,61.85 66.04,64.77 ENVMOD.2
N$62
  Top 0.254: R72.P$2 65.47,60.2 71.5,60.2 76.2,64.9 RES2.2
N$63
  Top 0.254: U4.6 7.24,25.78 R13.P$2 7.18,25.78 5.46,25.78 J2.2
N$64
  Top 0.254: D28.P$1 20.57,37.72 20.32,37.97 19.68,37.97 19.59,38.07 | 19.59,38.07 19.56,38.1 | D29.P$3 19.59,38.07
N$65
  Top 0.254: Q16.P$5 Q16.P$2
N$66
  Top 0.254: 23.05,42.1 23.11,42.04 | 23.05,42.1 D26.P$3 | 23.05,42.1 22.99,42.16 R117.P$2 21.08,42.16 21.08,41.27 20.57,40.77 D29.P$1
N$67
  Top 0.254: 23.82,24.28 C62.2 23.75,24.13 23.75,22.99 23.23,22.46 Q16.P$1 | 23.82,24.28 23.88,24.64 | 23.82,24.28 23.98,24.28 24,24.26 24.07,24.32 R152.P$1 | R138.P$2 22.73,26.04 23.37,26.67 R152.P$1 | R152.P$1 24.26,26.67
N$68
  Top 0.254: R152.P$2 25.72,28.38 25.53,28.57 24.77,28.57 24.86,28.67 D37.P$1
N$69  (via drill 0.43 pad 0.94)
  Top 0.254: R139.P$1 21.97,28.32 21.97,29.46 21.21,30.23 21.21,30.99 20.83,31.37 19.43,31.37 19.05,31.75 19.05,33.15 v18.41,33.78 18.41,34.16 18.03,34.54 U12.8
  Bottom 0.254: DECAY.3 26.42,64.52 24.38,64.52 23.37,63.5 23.37,60.07 16.64,53.34 16.64,47.12 17.91,45.85 17.91,42.67 16.89,41.66 16.89,38.86 19.56,36.2 19.56,34.92 v18.41,33.78
N$71  (via drill 0.43 pad 0.94)
  Top 0.254: 17.02,35.81 U12.9 v18.67,35.81 19.62,34.86 D28.P$3
  Bottom 0.254: DECAY.2 DECAY.1 22.86,60.33 16.13,53.59 16.13,46.86 17.4,45.59 17.4,42.93 16.38,41.91 16.38,38.1 v18.67,35.81
N$72
  Top 0.254: U12.3 11.43,39.62 11.37,39.69 U12.2 10.41,40.89 9.91,40.39 8.89,40.39 C35.1
N$73
  Top 0.254: U12.5 12.45,37.08 13.08,36.45 13.08,29.21 10.92,27.05 U4.5
N$74
  Top 0.254: U12.13 16,40.89 14.22,39.12 14.22,27.69 16.13,25.78 U4.11
N$75  (via drill 0.43 pad 0.94)
  Top 0.254: U6.2 44.96,54.36 45.21,54.1 45.21,52.45 | 45.21,52.45 45.21,52.07 | v46.1,40.13 46.1,50.93 45.21,51.82 | 45.21,51.82 45.21,52.45 | 45.21,51.82 U6.4 | v54.86,37.85 C17.2
  Bottom 0.254: v54.86,37.85 48.39,37.85 v46.1,40.13
N$76
  Top 0.254: U12.6 12.32,35.81 12.57,35.56 12.57,29.97 10.92,28.32 U4.4
N$77
  Top 0.254: R156.P$1 94.93,50.61 95.12,50.8 C58.1 95.12,52.83
N$78  (via drill 0.43 pad 0.94)
  Top 0.254: U12.11 18.41,38.35 19.3,39.24 v19.3,40.77
  Bottom 0.254: 33.02,66.17 ACCENT.1 33.02,63.88 35.69,61.21 35.69,58.17 19.3,41.78 v19.3,40.77
N$79  (via drill 0.43 pad 0.94)
  Top 0.254: ACCENT.2 35.56,67.82 36.45,68.71 75.82,68.71 77.47,67.06 77.47,64.77 74.42,61.72 74.42,58.8 | R119.P$1 82.55,26.04 82.3,26.29 82.3,32.51 82.3,33.15 v81.66,33.78 | v72.77,42.16 72.77,48.51 74.42,50.16 74.42,58.8 | D24.P$3 74.49,58.99 74.42,58.93 74.42,58.8
  Bottom 0.254: v81.66,33.78 81.15,33.78 v72.77,42.16
N$80
  Top 0.254: 78.74,60.96 R46.P$2 RES2.3
N$81
  Top 0.254: D24.P$1 76.17,61.12 77.85,59.44 78.74,59.44 78.8,59.37 | 78.8,59.37 78.87,59.31 | 78.8,59.37 R46.P$1
N$82
  Top 0.254: U12.12 15.62,39.62 14.73,38.73 14.73,29.08 15.49,28.32 U4.13
N$83  (via drill 0.43 pad 0.94)
  Top 0.254: R63.P$1 63.12,58.55 | R63.P$1 63.12,57.91 62.42,57.21 R71.P$2 62.36,56.52 62.36,55.24 | U6.10 50.8,50.55 v51.05,50.8 | Q27.P$2 61.47,54.74 61.98,55.24 62.36,55.24 | v62.87,55.24 62.36,55.24 | 71.25,55.88 J11.1 66.67,55.88 65.41,57.15 65.41,58.42 R72.P$1 R63.P$1
  Bottom 0.254: v51.05,50.8 58.42,50.8 v62.87,55.24
N$84
  Top 0.254: R144.P$1 30.48,43.94 30.54,43.88 30.54,42.8 | 30.54,42.8 R146.P$2 | 30.54,42.8 30.48,42.8 30.47,42.81 Q14.P$1
N$85
  Top 0.254: Q14.P$6 28.21,39.37 28.19,39.37 | C54.2 25.98,38.68 26.67,39.37 28.19,39.37 | 28.19,39.37 R143.P$1
N$86
  Top 0.254: U5.5 44.83,40.39 45.59,41.15 45.59,49.78 44.83,50.55 U6.5 43.81,50.55
N$87
  Top 0.254: 84.07,32.64 D27.P$1 | 84.07,32.64 84.07,34.16 | Q1.P$6 83.19,34.16 84.07,34.16 | 84.07,34.16 84.96,34.16 Q1.P$1 84.97,34.79 Q1.P$2 86.74,34.8 87.12,35.18 87.12,35.69 Q13.P$3 | 84.07,32.64 84.07,24.89 82.04,22.86 J9.3
N$88
  Top 0.254: U6.13 48.51,54.36 46.74,52.58 46.74,40.89 48.51,39.12 U5.11
N$89
  Top 0.254: R148.P$2 25.65,35.31 | 28.96,31.11 Q15.P$2 28.96,31.62 28.13,32.45 R149.P$1 27.43,33.27 26.67,34.04 26.67,34.8 26.42,35.05 R148.P$2 | R148.P$2 25.65,35.05
N$90
  Top 0.254: C55.P$1 28.97,24.62 28.13,25.46 R150.P$1 28.13,28.26 28.32,28.45 28.32,29.46 28.31,29.45 Q15.P$4
N$91
  Top 0.254: Q2.P$5 84.97,36.97 84.96,36.96 Q2.P$4 Q1.P$3 | Q1.P$3 | Q1.P$3 84.96,35.43
N$92  (via drill 0.43 pad 0.94)
  Top 0.254: 98.71,31.75 98.71,26.07 J10.1 | 98.71,31.75 D36.P$3 | R151.P$2 25.78,32.7 25.78,30.73 25.81,30.73 D37.P$3 25.81,30.86 26.92,30.86 v27.05,30.99 27.18,31.11 28.32,31.11 Q15.P$3 | v98.68,31.75 98.71,31.75
  Bottom 0.254: v27.05,30.99 48.9,30.99 49.66,31.75 v98.68,31.75
N$93  (via drill 0.43 pad 0.94)
  Top 0.254: R145.P$2 31.88,29.46 | Q15.P$6 31.74,29.33 R145.P$2 | 88.33,26.67 D35.P$3 | v87.25,26.67 88.33,26.67 | R145.P$2 32,28.19 35.05,25.15 v35.69,25.15 | D34.P$3 88.71,25.71 88.52,25.91 | 88.52,25.91 88.39,26.04 | 88.33,26.67 88.33,26.1 88.52,25.91
  Bottom 0.254: v87.25,26.67 55.12,26.67 53.59,25.15 v35.69,25.15
N$94
  Top 0.254: Q5.P$5 84.07,41.53 83.69,41.15 82.3,41.15 81.92,41.53 81.92,42.04 Q4.P$1 Q4.P$2 81.28,42.04 Q4.P$2 80.66,42.05 80.64,42.04 Q4.P$3
N$95
  Top 0.254: Q3.P$1 Q3.P$2 86.87,42.04 Q3.P$2 Q3.P$3 | Q3.P$3 86.12,42.05 86.11,42.04 | Q5.P$4 | Q3.P$3 Q5.P$4 | Q5.P$4 84.71,42.04
N$96
  Top 0.254: Q2.P$3 83.19,36.96 83.82,36.96 84.07,37.21 84.07,38.73 83.42,39.38 Q5.P$1 | Q5.P$1 Q4.P$6 | Q5.P$1 83.44,40.26
N$97
  Top 0.254: Q7.P$4 Q6.P$3 | Q6.P$3 86.23,45.72 | Q6.P$3 86.86,45.73 Q6.P$2 87.49,45.73 87.5,45.72 Q6.P$1
N$98
  Top 0.254: Q5.P$6 83.42,43.05 | 83.42,43.05 Q7.P$1 | Q7.P$3 84.72,43.32 84.45,43.05 83.42,43.05 | Q7.P$1 83.44,43.94 82.68,43.94 82.42,44.2 R128.P$1 R127.P$1 81.41,46.48 | Q7.P$1
N$99
  Top 0.254: Q13.P$4 87.11,32.65 87.5,32.26 87.5,31.5 87.63,31.37 R131.P$2
N$100
  Top 0.254: Q2.P$6 84.97,38.6 84.07,39.5 84.07,40.13 | Q5.P$2 84.07,40.13 | Q3.P$6 87.52,40.88 87.25,41.15 84.45,41.15 84.07,40.77 84.07,40.13
N$101  (via drill 0.43 pad 0.94)
  Top 0.254: Q7.P$2 84.07,44.45 84.45,44.83 v85.47,44.83 87.12,44.83 87.5,44.45 87.5,43.81 87.52,43.83 Q6.P$6 | Q5.P$3 85.1,40.25 85.47,39.88 v85.47,39.37
  Bottom 0.254: v85.47,39.37 v85.47,44.83
N$102
  Top 0.254: 83.5,48.96 83.44,49.02 | R20.P$2 83.5,48.96 | 83.5,48.96 83.68,48.78 Q9.P$1 85.97,48.14 Q9.P$2 85.97,47.51 85.98,47.5 Q9.P$3
N$103
  Top 0.254: Q9.P$6 Q10.P$1 | Q9.P$6 87.76,48.77 | Q9.P$6 87.14,48.78 86.87,48.51 86.87,46.99 86.49,46.61 84.45,46.61 84.07,46.23 Q7.P$5
N$104
  Top 0.254: C56.1 90.6,59.26 90.55,59.31 R165.P$1 81.98,59.24 81.28,59.94 J7.1
N$105
  Top 0.254: 83.44,50.93 R21.P$2 Q10.P$5 86.61,50.93 86.87,51.18 86.87,52.2 86.49,52.58 C38.2
N$106  (via drill 0.43 pad 0.94)
  Top 0.254: C38.1 v86.49,57.15
  Bottom 0.254: v86.49,57.15 85.09,58.55 85.09,63.25 83.82,64.52 VOL.1
N$107
  Top 0.254: C59.2 97.54,58.67 91.82,64.39 86.87,64.39 86.36,64.9 VOL.2 86.49,66.17
N$108
  Top 0.254: R155.P$1 97.22,50.61 97.54,50.93 C59.1
N$109
  Top 0.254: Q11.P$1 89.8,44.95 89.79,44.96 R157.P$2 C52.2 89.79,42.16
N$110
  Top 0.254: Q10.P$2 88.52,50.93 88.77,50.67 89.66,50.67 89.79,50.55 R158.P$2
N$111
  Top 0.254: Q10.P$3 87.77,52.08 88.77,53.09 R160.P$2 88.77,53.85 91.57,53.85 91.95,53.47 91.95,52.96 | 91.95,50.55 R153.P$2 91.95,52.96 | R161.P$2 92.01,53.02 91.95,52.96
N$112
  Top 0.254: R153.P$1 94.17,48.96 94.23,49.02 | 94.23,49.02 R156.P$2 | R155.P$2 94.3,48.96 94.23,49.02 | Q11.P$5 92.2,47.62 91.95,47.88 R153.P$1 | R153.P$1 91.95,49.02
N$113
  Top 0.254: 90.81,48.9 90.81,48.26 91.57,47.5 91.57,46.74 Q11.P$6 | 90.81,48.9 R154.P$1 | R158.P$1 90.74,48.96 90.81,48.9
N$114
  Top 0.254: R154.P$2 90.81,54.61 83.69,54.61 | Q10.P$4 85.2,51.58 84.84,51.94 84.84,52.45 84.2,53.09 R136.P$2 | R136.P$2 83.44,53.09 | C53.P$1 76.71,54.61 83.69,54.61 | R136.P$2 83.5,54.61 83.69,54.61
N$115
  Top 0.254: 92.84,57.15 C56.2 R161.P$1
N$116
  Top 0.254: 77.72,46.48 R129.P$1 R127.P$2
N$117
  Top 0.254: J1.15 J1.16 30.48,12.57 37.34,19.43 37.34,25.91 34.16,29.08 34.16,31.5 32.19,33.47 R146.P$1 32.13,41.66
N$118
  Top 0.254: R128.P$2 78.74,44.2 78.49,44.45 77.47,44.45 | 77.47,44.45 R162.P$2 | 75.18,44.45 77.47,44.45 | R129.P$2 75.44,46.48 75.18,46.23 75.18,44.45 | C40.1 75.18,44.45
N$119
  Top 0.254: 90.42,35.81 C42.1 90.42,37.59 | 88.52,37.59 90.42,37.59 | Q13.P$2 87.76,36.32 88.01,36.58 88.27,36.58 88.52,36.83 88.52,37.59 | R123.P$2 88.52,37.59 | R132.P$1 91.06,38.23 90.42,37.59
N$120
  Top 0.254: Q11.P$3 92.85,44.44 93.34,43.94 93.34,38.48 93.6,38.23 R132.P$2 94.23,38.23
N$121
  Top 0.254: R130.P$2 95.12,46.74 95.11,46.75 Q11.P$4
N$122
  Top 0.254: Q11.P$2 92.2,44.2 92.46,43.94 92.46,43.05 | C41.1 92.33,40.51 arc90 92.46,40.64 92.46,42.93 | 92.46,42.93 92.46,43.05 | 92.46,42.93 92.46,43.05 | R134.P$1 92.52,42.99 92.46,42.93
N$123
  Top 0.254: 94.11,43.05 R134.P$2 D36.P$1
N$124
  Top 0.254: 89.28,31.37 R131.P$1 | D35.P$1 89.28,31.37 | 89.28,31.37 89.53,31.62
N$125
  Top 0.254: D27.P$3 83.16,30.35 83.19,30.35 83.19,28.38 R120.P$2
N$126
  Top 0.254: R120.P$1 84.9,26.1 84.84,26.04 R119.P$2 84.9,23.43 84.89,23.42 | 84.89,23.42 84.84,23.37 | C36.1 84.89,23.42
N$127
  Top 0.254: Q2.P$2 82.68,37.59 80.64,35.56 80.64,34.92 | 80.64,34.92 R124.P$2 | 80.64,34.92 80.64,32.64 R122.P$1 80.64,32.58 80.64,30.35 R121.P$1 80.64,30.29 80.64,28.96 76.2,24.51 J9.1 76.2,22.73
N$128
  Top 0.254: Q2.P$1 82.44,38.24 81.15,36.96 R125.P$2 80.26,36.96
N$129
  Top 0.254: R125.P$1 78.93,36.89 78.99,36.83 78.99,36.96 R125.P$1 | 76.83,36.7 77.85,36.7 78.11,36.96 R125.P$1 | R124.P$1 R125.P$1 | R126.P$2 77.47,38.35 76.83,37.72 76.83,36.7 | 76.83,36.7 C37.1
N$130
  Top 0.254: 78.99,30.35 R121.P$2 C21.1
N$131
  Top 0.254: C20.1 76.71,32.82 76.71,32.77 78.8,32.77 R122.P$2
N$132
  Top 0.254: R97.P$2 61.21,42.8 60.96,43.05 60.96,44.07 61.01,44.12 C23.2
N$133
  Top 0.254: U5.13 48.01,41.66 47.24,42.42 47.24,51.82 48.51,53.09 U6.12 49.66,53.09
N$134
  Top 0.254: U5.4 44.83,41.66 45.09,41.91 45.09,49.02 44.83,49.28 U6.6 43.69,49.28
N$135
  Top 0.508: R1.P$2 57.72,10.6 57.66,10.67 57.67,10.68 C7.P$1 57.78,10.79 59.69,10.79 61.67,12.78 U2.8
N$136
  Top 0.254: U1.P$2 41.78,7.62 42.04,7.37 42.04,5.84 42.74,5.14 R4.P$2 47.69,5.14 47.75,5.21 R3.P$2 49.85,5.14 49.91,5.21 R2.P$1 51.88,5.14 52.2,4.83 C6.2
N$138
  Top 0.254: R102.P$2 24.13,48.26 25.65,46.74 25.65,45.59 TM4.P$2
N$139
  Top 0.254: 43.31,8.63 U1.P$5
  Top 0.762: L1.P$2 42.66,10.17 43.05,9.78 43.43,9.78 | 43.43,9.78 D1.P$2 | 43.43,9.78 43.43,8.64 43.31,8.63
N$140
  Top 0.254: 14.99,60.71 R118.P$1 15.05,58.36 15.24,58.17 | Q26.P$2 19.18,53.85 | Q26.P$2 | TM5.P$2 14.22,55.37 | 14.22,55.37 14.22,56.13 15.24,57.15 15.24,58.17 | TM5.P$1 15.24,58.29 15.24,58.17 | 17.27,53.66 14.54,53.66 14.22,53.98 14.22,55.37 | 17.27,53.66 R100.P$2 | 17.27,53.66 17.27,53.85 Q26.P$2
N$141
  Top 0.254: R23.P$1 51.94,48.01 U6.8
N$143
  Top 0.254: R7.P$1 70.17,5.27 70.99,6.1 72.52,6.1 TM1.P$1
N$144
  Top 0.254: U2.6 65.53,15.24 R9.P$1 R11.P$2 | R11.P$2 67.69,15.24 | R11.P$2 67.63,13.53 68.07,13.08 R10.P$2 68.96,13.08
N$145
  Top 0.254: C58.2 95.12,59.44 93.6,60.96 J7.3
N$146
  Top 0.254: 68.58,4.57 R7.P$2 68.45,4.57 | U3.P$3 68.52,4.64 68.45,4.57 | R6.P$1 65.53,4.57 | R6.P$1 65.6,4.45 65.53,4.45 U2.3 | R6.P$1 68.45,4.57
N$147
  Top 0.254: 63.88,4.57 R6.P$2 62.1,4.57 61.47,5.21 R5.P$2 57.72,3.24 58.04,2.92 C8.1
N$148
  Top 0.254: R118.P$2 13.4,61.78 15.24,63.63 TUNE.2
N$149
  Top 0.254: D34.P$1 92.2,24.77 92.58,25.15 R137.P$2 92.58,27.81
N$150
  Top 0.254: Q25.P$2 60.33,46.99 59.82,46.48 58.8,46.48 R67.P$2 R99.P$1
N$151
  Top 0.254: U4.10 13.59,24.51 12.95,25.15 8.64,25.15 8.38,24.89 8.38,22.61 8,22.23 7.37,22.23 7.3,22.16 R12.P$2 5.91,22.16 4.06,20.32 J2.1
N$152  (via drill 0.43 pad 0.94)
  Top 0.254: v48.13,42.93 U5.14 | J3.6 36.96,45.72 36.32,45.09 35.31,45.09 R19.P$2
  Bottom 0.254: v48.13,42.93 42.29,42.93 39.5,45.72 J3.6
N$153
  Top 0.254: J3.1 39.24,33.02 39.75,33.53 39.75,34.16 40.13,34.54 41.02,34.54 R16.P$2 41.02,35.43 40.64,35.81 40.64,37.85 41.27,38.48 45.34,38.48 45.97,37.85 U5.10
N$154
  Top 0.254: U5.6 40.64,39.12 40.01,38.48 40.01,36.2 39.37,35.56 J3.2 36.07,35.56 35.31,36.32 R17.P$2 35.31,37.21
N$155
  Top 0.254: U5.3 40.51,42.93 40.26,43.18 J3.5 36.96,43.18 36.45,42.67 35.18,42.67 35.24,42.74 R18.P$2
N$158
  Top 0.254: R5.P$1 56.01,5.21 56.07,5.27 R1.P$1
  Top 0.508: R1.P$1 54.1,7.37 53.85,7.11 52.32,7.11 | C6.1 52.12,7.06 52.07,7.11 52.32,7.11 | 52.32,7.11 52.01,6.79 R2.P$2 49.91,8.26 50.29,8.64 50.29,12.19
  Top 0.762: 49.15,12.19 49.18,12.16 50.29,12.16 50.29,12.19 C3.1 | C3.1 C2.1 | C4.1 C5.1 | C4.1 48.01,12.19 | C3.1 49.15,12.24 | 49.15,12.24 C4.1 | 49.15,12.24 49.15,12.19 | D1.P$1 49.15,9.81 49.15,12.19
N$159
  Top 0.254: R8.P$2 74.53,3.44 TM1.P$3 74.53,7.13 73.53,8.13 | U3.P$2 70.39,7.97 70.36,8 70.48,8.13 73.53,8.13 | 73.53,8.13 TM1.P$2
N$160  (via drill 0.43 pad 0.94)
  Top 0.254: v15.62,29.59 U4.14 | v7.24,31.24 R15.P$2 7.18,33.02 J2.6
  Bottom 0.254: v15.62,29.59 8,29.59 7.24,30.35 v7.24,31.24
N$161
  Top 0.254: U4.3 7.24,29.59 R14.P$2 7.18,29.59 3.43,29.59 J2.5
PE  (via drill 0.43 pad 0.94)
  Top 0.254: R151.P$1 24.13,33.27
  other vias: 53.72,2.54 45.09,8.38 39.88,5.33 51.44,16.13 66.67,9.14 25.91,59.82 55.5,48.64 54.48,34.42 59.82,41.4 43.81,46.61 25.27,20.95 46.61,54.36 9.14,36.45 41.91,28.96 49.15,22.23 33.53,28.07 69.09,42.29 32.13,46.1 31.62,32.51 11.68,21.08 70.99,2.16 7.24,41.78 40.51,9.91 46.86,16.13 72.01,14.86 62.1,16.64 80.52,17.78 13.84,26.04 14.22,48.01 55.88,21.97 27.81,46.86 22.48,32.89 85.98,2.79 33.78,54.23 31.37,16.76 34.29,12.57 44.32,35.18 58.17,53.85 40.64,21.97 49.91,58.93 55.12,54.48 36.2,23.37 80.9,9.14 76.33,8.76 34.54,48.51 64.01,33.91 70.61,20.45 89.66,20.57 93.6,33.02 68.45,33.4 76.45,27.81 69.98,30.61 64.14,27.94 47.62,29.46 72.77,34.8 68.45,51.18 74.17,46.86 10.41,60.33 45.85,32.89 98.68,46.99 79.5,38.99 82.04,35.43 88.27,38.99 88.01,57.78 27.81,54.74 49.15,46.74 67.82,63.37 84.71,49.78
  pour Bottom: 101.6,69.85 101.6,0 0,0 0,69.85
  pour Top: 101.6,69.85 101.6,0 0,0 0,69.85
R52
  Top 0.254: C54.1 23.75,37.59 24.07,37.27 R148.P$1
R62
  Top 0.254: R143.P$2 29.21,39.37 28.96,39.12 28.96,37.59 28.7,37.34 R142.P$1 28.13,35.5 27.94,35.31 | Q15.P$1 29.61,31.73 28.96,32.38 28.96,35.05 28.7,35.31 27.94,35.31 | C72.1 27.94,35.31
V+  (via drill 0.43 pad 0.94)
  Top 0.254: 28.96,29.21 28.96,28.45 29.78,27.62 R150.P$2 29.78,25.59 31.37,24 v31.37,19.3 | 28.96,29.21 Q15.P$5 | 15.37,32.89 15.37,32.77 | 15.37,32.89 15.37,38.48 15.88,38.99 18.16,38.99 18.41,39.24 18.41,41.78 18.03,42.16 17.14,42.16 | 17.02,42.16 U12.14 17.14,42.16 | 15.37,48.13 U11.8 17.09,48.59 18.03,49.53 18.03,50.04 | 17.14,42.16 16.13,42.16 14.73,43.56 14.73,44.83 15.37,45.47 15.37,48.13 | 15.37,51.31 15.27,51.22 D31.P$1 15.37,51.18 15.37,48.13 | TM4.P$1 22.46,46.5 22.48,46.48 22.48,47.62 21.84,48.26 R103.P$2 21.84,49.78 21.59,50.04 18.03,50.04 | Q18.P$5 31.5,56.13 31.88,56.52 32.64,56.52 33.27,57.15 34.16,57.15 34.1,57.21 | 34.1,57.21 R45.P$1 | 28.96,29.21 28.96,29.84 29.34,30.23 29.97,30.23 30.48,30.73 30.48,31.75 29.78,32.45 R149.P$2 29.78,34.99 29.97,35.18 | C72.2 30.1,35.31 29.97,35.18 | R142.P$2 29.78,35.37 29.97,35.18 | Q16.P$6 19.81,22.48 v19.81,21.34 | U4.16 v15.62,32.13 15.37,32.38 15.37,32.89 | Q16.P$3 21.6,24.37 21.34,24.64 v20.7,24.64 | 24.86,54.99 24.89,54.99 | 24.86,54.99 Q28.P$2 | v23.11,56.13 23.11,55.88 24,54.99 24.86,54.99 | 34.1,57.21 34.04,57.28 v34.04,59.05 | 18.03,50.04 v18.03,51.18 | CUTOFF.1 43.18,63.63 49.53,57.28 49.53,55.63 U6.14 50.55,55.63 50.8,55.37 50.8,52.7 50.55,52.45 48.64,52.45 47.75,51.56 47.75,46.23 48.51,45.47 U5.16 | R23.P$2 49.97,46.29 49.66,45.97 U5.16 | Q4.P$4 80.64,40.26 80.66,40.25 | R21.P$1 R136.P$1 | 81.85,50.86 R21.P$1 | 81.85,50.86 81.92,50.8 | R21.P$1 81.92,50.93 81.85,50.86 | 81.85,50.86 R20.P$1 81.85,47.5 81.92,47.5 | Q7.P$6 83.44,45.72 83.44,46.23 82.17,47.5 81.92,47.5 | Q3.P$5 86.86,40.25 Q3.P$4 86.23,40.26 | 80.66,40.25 80.66,40.88 80.01,41.53 80.01,42.8 80.52,43.31 80.52,47.12 80.9,47.5 81.92,47.5
  Top 0.254: Q3.P$5 | Q3.P$5 v86.87,39.12 86.87,37.59 R123.P$1 | 80.66,40.25 Q4.P$5 | Q4.P$5 78.98,40.25 78.49,39.75 76.2,39.75 | Q4.P$5 v81.28,39.12 | R95.P$2 43.81,20.95 43.81,21.08 | 51.05,45.09 50.67,45.47 U5.16 | U5.16 49.53,45.47
  Top 0.508: U2.7 64.26,13.97 63.88,14.35 63.88,15.24 | 63.88,15.24 R9.P$2 | 63.88,15.24 63.88,16.26 64.39,16.76 76.2,16.76 77.85,15.11 77.85,13.46 C32.P$1 78.61,13.7 | 78.61,15.62 78.61,13.7 | 78.61,15.62 78.61,15.75 | 78.61,13.7 78.61,11.94 79.76,10.79 87.63,10.79 89.53,12.7 J4.3 91.57,12.7 | v75.82,19.3 78.61,16.51 78.61,15.62 | v43.81,19.3 43.81,21.08 43.81,28.83 51.56,36.58 51.56,44.58 51.05,45.09 | v72.9,19.3 72.9,31.62 71.5,33.02 71.5,38.73 72.52,39.75 76.2,39.75
  Bottom 0.254: 30.48,19.3 30.48,19.18 30.61,19.3 v31.37,19.3 | v43.81,19.3 43.81,19.18 | v34.04,59.05 31.11,56.13 23.24,56.13 | 23.24,56.13 v23.11,56.13 | v18.03,51.18 22.99,56.13 23.24,56.13 | v81.28,39.12 81.92,38.48 86.23,38.48 v86.87,39.12 | 73.03,19.18 73.03,19.3 v72.9,19.3 | v20.7,24.64 20.7,22.23 v19.81,21.34 18.8,20.32
  Bottom 0.508: 21.34,19.3 20.83,19.3 | 21.34,19.3 30.48,19.3 v31.37,19.3 v43.81,19.3 73.03,19.3 v75.82,19.3 | v15.62,32.13 16.51,32.13 17.53,31.11 17.53,27.81 16.38,26.67 16.38,22.73 18.8,20.32 19.81,19.3 21.34,19.3

## Text on the board
tPlace: 1 | 1 | 1 | 1 | 1 | 1 | 1 | 1 | 1 | 1 | 1 | 1 | 1 | 1 | 1 | 1 | 1 | x0x-heart | 1 | 1 | openmusiclabs